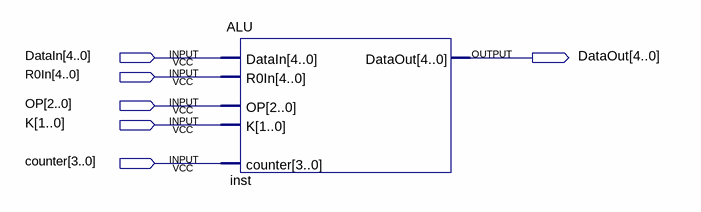
[diagram p0: schematic sheet]
// Quartus schematic convert.bdf as structural Verilog: 1 symbols, 6 pins
module convert (
  input  [4:0] DataIn,
  input  [4:0] R0In,
  input  [2:0] OP,
  input  [1:0] K,
  input  [3:0] counter,
  output [4:0] DataOut
);

  ALU inst (.DataIn(DataIn), .R0In(R0In), .OP(OP), .counter(counter), .K(K), .DataOut(DataOut));
endmodule
